# Altium schematic sheet 8chUSBtoserial.SchDoc
size A3
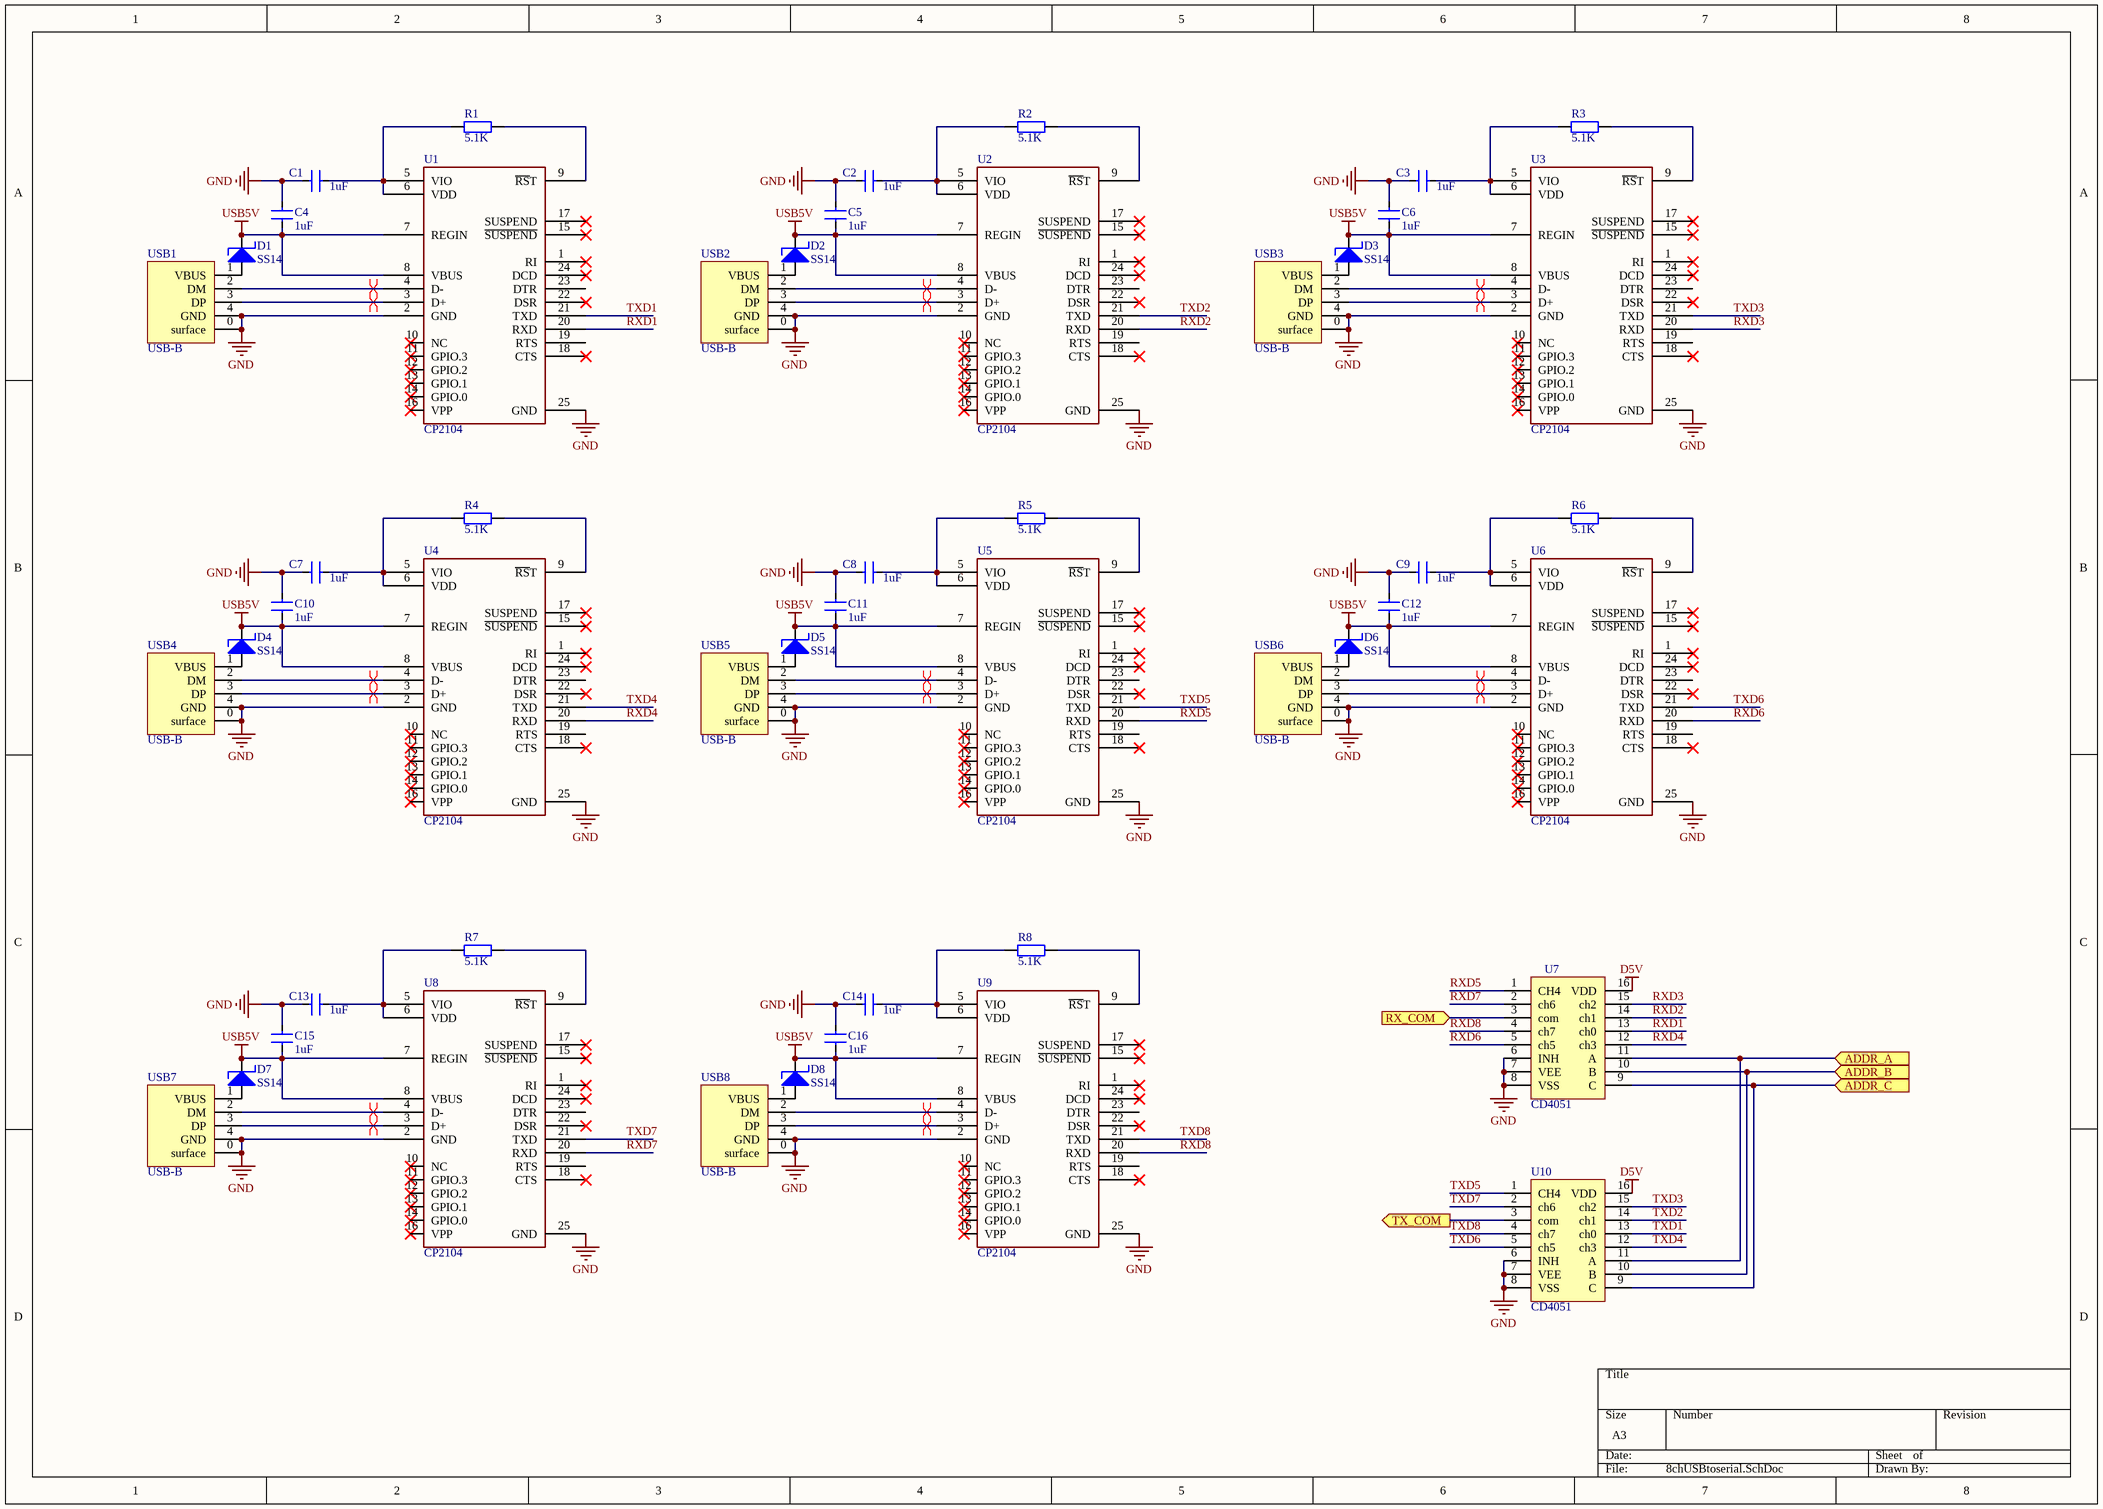
[diagram p0: 8chUSBtoserial.SchDoc]

## Parts
C1  1uF  [0603C]
C2  1uF  [0603C]
C3  1uF  [0603C]
C4  1uF  [0603C]
C5  1uF  [0603C]
C6  1uF  [0603C]
C7  1uF  [0603C]
C8  1uF  [0603C]
C9  1uF  [0603C]
C10  1uF  [0603C]
C11  1uF  [0603C]
C12  1uF  [0603C]
C13  1uF  [0603C]
C14  1uF  [0603C]
C15  1uF  [0603C]
C16  1uF  [0603C]
D1  SS14  [SOD123]
D2  SS14  [SOD123]
D3  SS14  [SOD123]
D4  SS14  [SOD123]
D5  SS14  [SOD123]
D6  SS14  [SOD123]
D7  SS14  [SOD123]
D8  SS14  [SOD123]
R1  5.1K  [0603R]
R2  5.1K  [0603R]
R3  5.1K  [0603R]
R4  5.1K  [0603R]
R5  5.1K  [0603R]
R6  5.1K  [0603R]
R7  5.1K  [0603R]
R8  5.1K  [0603R]
U1  CP2104  [QFN24]
U2  CP2104  [QFN24]
U3  CP2104  [QFN24]
U4  CP2104  [QFN24]
U5  CP2104  [QFN24]
U6  CP2104  [QFN24]
U7  CD4051  [SOP16]
U8  CP2104  [QFN24]
U9  CP2104  [QFN24]
U10  CD4051  [SOP16]
USB1  USB-B  [USB-B]
USB2  USB-B  [USB-B]
USB3  USB-B  [USB-B]
USB4  USB-B  [USB-B]
USB5  USB-B  [USB-B]
USB6  USB-B  [USB-B]
USB7  USB-B  [USB-B]
USB8  USB-B  [USB-B]

## Ports
ADDR_A (in), ADDR_B (in), ADDR_C (in), RX_COM (in), TX_COM (out)

## Nets
D5V: U7.16(VDD) U10.16(VDD)
GND: C1.2 C2.2 C3.2 C4.1 C5.1 C6.1 C7.2 C8.2 C9.2 C10.1 C11.1 C12.1 C13.2 C14.2 C15.1 C16.1 U1.2(GND) U1.25(GND) U2.2(GND) U2.25(GND) U3.2(GND) U3.25(GND) U4.2(GND) U4.25(GND) U5.2(GND) U5.25(GND) U6.2(GND) U6.25(GND) U7.6(INH) U7.7(VEE) U7.8(VSS) U8.2(GND) U8.25(GND) U9.2(GND) U9.25(GND) U10.6(INH) U10.7(VEE) U10.8(VSS) USB1.0(surface) USB1.4(GND) USB2.0(surface) USB2.4(GND) USB3.0(surface) USB3.4(GND) USB4.0(surface) USB4.4(GND) USB5.0(surface) USB5.4(GND) USB6.0(surface) USB6.4(GND) USB7.0(surface) USB7.4(GND) USB8.0(surface) USB8.4(GND)
USB5V: C4.2 C5.2 C6.2 C10.2 C11.2 C12.2 C15.2 C16.2 D1.K D2.K D3.K D4.K D5.K D6.K D7.K D8.K U1.7(REGIN) U1.8(VBUS) U2.7(REGIN) U2.8(VBUS) U3.7(REGIN) U3.8(VBUS) U4.7(REGIN) U4.8(VBUS) U5.7(REGIN) U5.8(VBUS) U6.7(REGIN) U6.8(VBUS) U8.7(REGIN) U8.8(VBUS) U9.7(REGIN) U9.8(VBUS)
ADDR_A: U7.11(A) U10.11(A) ; port ADDR_A
ADDR_B: U7.10(B) U10.10(B) ; port ADDR_B
ADDR_C: U7.9(C) U10.9(C) ; port ADDR_C
RX_COM: U7.3(com) ; port RX_COM
RXD1: U1.20(RXD) U7.13(ch0)
RXD2: U2.20(RXD) U7.14(ch1)
RXD3: U3.20(RXD) U7.15(ch2)
RXD4: U4.20(RXD) U7.12(ch3)
RXD5: U5.20(RXD) U7.1(CH4)
RXD6: U6.20(RXD) U7.5(ch5)
RXD7: U7.2(ch6) U8.20(RXD)
RXD8: U7.4(ch7) U9.20(RXD)
TX_COM: U10.3(com) ; port TX_COM
TXD1: U1.21(TXD) U10.13(ch0)
TXD2: U2.21(TXD) U10.14(ch1)
TXD3: U3.21(TXD) U10.15(ch2)
TXD4: U4.21(TXD) U10.12(ch3)
TXD5: U5.21(TXD) U10.1(CH4)
TXD6: U6.21(TXD) U10.5(ch5)
TXD7: U8.21(TXD) U10.2(ch6)
TXD8: U9.21(TXD) U10.4(ch7)
NetC1_1: C1.1 R1.1 U1.5(VIO) U1.6(VDD)
NetC2_1: C2.1 R2.1 U2.5(VIO) U2.6(VDD)
NetC3_1: C3.1 R3.1 U3.5(VIO) U3.6(VDD)
NetC7_1: C7.1 R4.1 U4.5(VIO) U4.6(VDD)
NetC8_1: C8.1 R5.1 U5.5(VIO) U5.6(VDD)
NetC9_1: C9.1 R6.1 U6.5(VIO) U6.6(VDD)
NetC13_1: C13.1 R7.1 U8.5(VIO) U8.6(VDD)
NetC14_1: C14.1 R8.1 U9.5(VIO) U9.6(VDD)
NetD1_A: D1.A USB1.1(VBUS)
NetD2_A: D2.A USB2.1(VBUS)
NetD3_A: D3.A USB3.1(VBUS)
NetD4_A: D4.A USB4.1(VBUS)
NetD5_A: D5.A USB5.1(VBUS)
NetD6_A: D6.A USB6.1(VBUS)
NetD7_A: D7.A USB7.1(VBUS)
NetD8_A: D8.A USB8.1(VBUS)
NetR1_2: R1.2 U1.9(~{RS}T)
NetR2_2: R2.2 U2.9(~{RS}T)
NetR3_2: R3.2 U3.9(~{RS}T)
NetR4_2: R4.2 U4.9(~{RS}T)
NetR5_2: R5.2 U5.9(~{RS}T)
NetR6_2: R6.2 U6.9(~{RS}T)
NetR7_2: R7.2 U8.9(~{RS}T)
NetR8_2: R8.2 U9.9(~{RS}T)
NetU1_3: U1.3(D+) USB1.3(DP)
NetU1_4: U1.4(D-) USB1.2(DM)
NetU2_3: U2.3(D+) USB2.3(DP)
NetU2_4: U2.4(D-) USB2.2(DM)
NetU3_3: U3.3(D+) USB3.3(DP)
NetU3_4: U3.4(D-) USB3.2(DM)
NetU4_3: U4.3(D+) USB4.3(DP)
NetU4_4: U4.4(D-) USB4.2(DM)
NetU5_3: U5.3(D+) USB5.3(DP)
NetU5_4: U5.4(D-) USB5.2(DM)
NetU6_3: U6.3(D+) USB6.3(DP)
NetU6_4: U6.4(D-) USB6.2(DM)
NetU8_3: U8.3(D+) USB7.3(DP)
NetU8_4: U8.4(D-) USB7.2(DM)
NetU9_3: U9.3(D+) USB8.3(DP)
NetU9_4: U9.4(D-) USB8.2(DM)

Not connected (* = marked no-connect by the designer): U1 1(RI)* 10(NC)* 11(GPIO.3)* 12(GPIO.2)* 13(GPIO.1)* 14(GPIO.0)* 15(~{SUSPEND})* 16(VPP)* 17(SUSPEND)* 18(CTS)* 19(RTS) 22(DSR)* 23(DTR) 24(DCD)*; U2 1(RI)* 10(NC)* 11(GPIO.3)* 12(GPIO.2)* 13(GPIO.1)* 14(GPIO.0)* 15(~{SUSPEND})* 16(VPP)* 17(SUSPEND)* 18(CTS)* 19(RTS) 22(DSR)* 23(DTR) 24(DCD)*; U3 1(RI)* 10(NC)* 11(GPIO.3)* 12(GPIO.2)* 13(GPIO.1)* 14(GPIO.0)* 15(~{SUSPEND})* 16(VPP)* 17(SUSPEND)* 18(CTS)* 19(RTS) 22(DSR)* 23(DTR) 24(DCD)*; U4 1(RI)* 10(NC)* 11(GPIO.3)* 12(GPIO.2)* 13(GPIO.1)* 14(GPIO.0)* 15(~{SUSPEND})* 16(VPP)* 17(SUSPEND)* 18(CTS)* 19(RTS) 22(DSR)* 23(DTR) 24(DCD)*; U5 1(RI)* 10(NC)* 11(GPIO.3)* 12(GPIO.2)* 13(GPIO.1)* 14(GPIO.0)* 15(~{SUSPEND})* 16(VPP)* 17(SUSPEND)* 18(CTS)* 19(RTS) 22(DSR)* 23(DTR) 24(DCD)*; U6 1(RI)* 10(NC)* 11(GPIO.3)* 12(GPIO.2)* 13(GPIO.1)* 14(GPIO.0)* 15(~{SUSPEND})* 16(VPP)* 17(SUSPEND)* 18(CTS)* 19(RTS) 22(DSR)* 23(DTR) 24(DCD)*; U8 1(RI)* 10(NC)* 11(GPIO.3)* 12(GPIO.2)* 13(GPIO.1)* 14(GPIO.0)* 15(~{SUSPEND})* 16(VPP)* 17(SUSPEND)* 18(CTS)* 19(RTS) 22(DSR)* 23(DTR) 24(DCD)*; U9 1(RI)* 10(NC)* 11(GPIO.3)* 12(GPIO.2)* 13(GPIO.1)* 14(GPIO.0)* 15(~{SUSPEND})* 16(VPP)* 17(SUSPEND)* 18(CTS)* 19(RTS) 22(DSR)* 23(DTR) 24(DCD)*

## Layout directives
differential pair: NetU1_3, NetU1_4, NetU2_3, NetU2_4, NetU3_3, NetU3_4, NetU4_3, NetU4_4, NetU5_3, NetU5_4, NetU6_3, NetU6_4, NetU8_3, NetU8_4, NetU9_3, NetU9_4

## Library data of the parts
C1-C16 = CAP: 普通小电容
D1-D8 = D-S: 肖特基二极管
R1-R8 = RES: 普通电阻
U7 U10 = CD4051: 模拟多路复用器
USB1-USB8 = USB-B: USB 1.1, Right Angle, SMT, A Type, Plug, 4 Position, Natural; ContactMaterial: Brass; ContactPlating: Gold (30) over Nickel (50); PCB_Layout: Complies with manufacturer's recommendation.; DrillSize: Corresponds to nominal value.; PanelGround: Without; Published: 15-Jul-2004; DatasheetDocument: 21-Jan-2003; PackageDocument: 21-Jan-2003; PackageReference: 1470695A; Publisher: Altium Limited; HousingMaterial: Thermoplastic; ComponentLink1Description: Manufacturer Link; ComponentLink1URL: http://www.tycoelectronics.com/; ComponentLink2Description: Packaging Specification; ComponentLink2URL: http://ecommas.tycoelectronics.com/commerce/DocumentDelivery/DDEController?Action=showdoc&DocId=Customer+Drawing%7F1470695%7FO%7Fpdf%7FEnglish%7FC_1470695_O.pdf